# Altium schematic sheet ADC.SchDoc: Data acquisition
size A4; DrawnBy: Daniel Berard; Engineer: Daniel Berard; DocumentNumber: 1; Revision: 1; SheetNumber: 1; SheetTotal: 4; ProjectName: STM
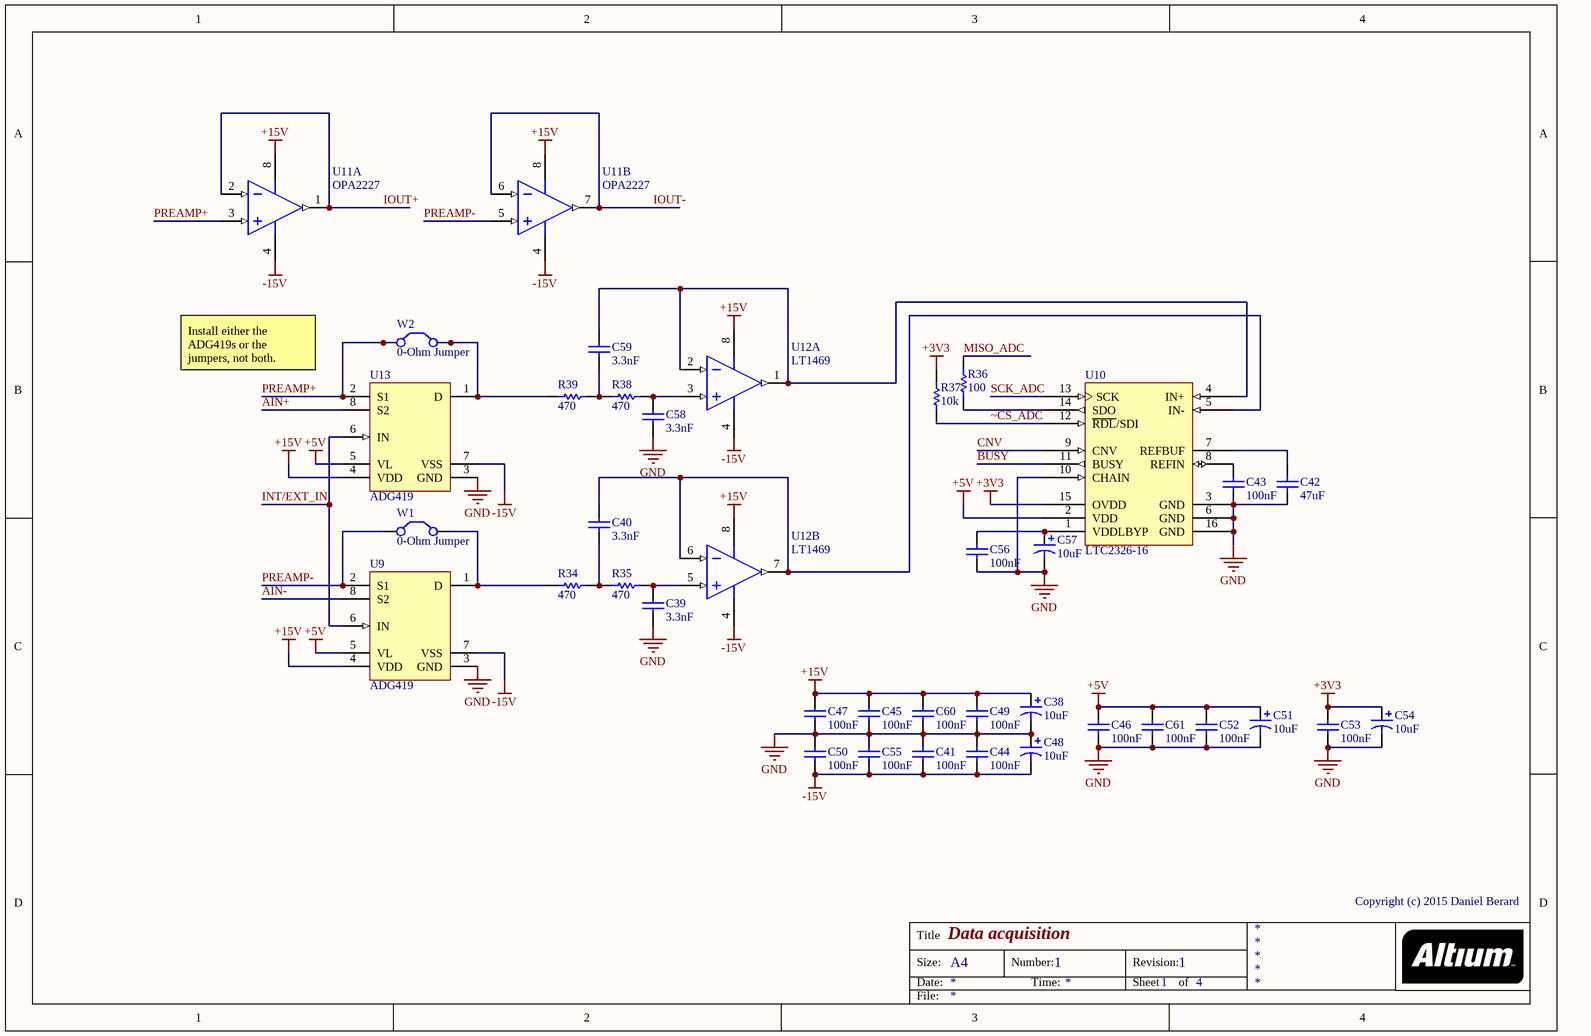
[diagram p0: ADC.SchDoc]

## Parts
C38  10uF  [3528]
C39  3.3nF  [6-0805_N]
C40  3.3nF  [6-0805_N]
C41  100nF  [6-0805_N]
C42  47uF  [C1210]
C43  100nF  [6-0805_N]
C44  100nF  [6-0805_N]
C45  100nF  [6-0805_N]
C46  100nF  [6-0805_N]
C47  100nF  [6-0805_N]
C48  10uF  [3528]
C49  100nF  [6-0805_N]
C50  100nF  [6-0805_N]
C51  10uF  [6-0805_N]
C52  100nF  [6-0805_N]
C53  100nF  [6-0805_N]
C54  10uF  [6-0805_N]
C55  100nF  [6-0805_N]
C56  100nF  [6-0805_N]
C57  10uF  [6-0805_N]
C58  3.3nF  [6-0805_N]
C59  3.3nF  [6-0805_N]
C60  100nF  [6-0805_N]
C61  100nF  [6-0805_N]
R34  470  [6-0805_N]
R35  470  [6-0805_N]
R36  100  [6-0805_N]
R37  10k  [6-0805_N]
R38  470  [6-0805_N]
R39  470  [6-0805_N]
U9  ADG419  [ADI-RM-8_N]
U10  LTC2326-16  [MSOP-16]
U11  OPA2227  [TI-D8_N]  (parts A,B of 2)
U12  LT1469  [LT-S8-8_N]  (parts A,B of 2)
U13  ADG419  [ADI-RM-8_N]
W1  0-Ohm Jumper  [6-0805_N]
W2  0-Ohm Jumper  [6-0805_N]

## Nets
+3V3: C53.2 C54.1 R37.2 U10.15(OVDD)
+5V: C46.2 C51.1 C52.2 C61.2 U9.5(VL) U10.2(VDD) U13.5(VL)
+15V: C38.1 C45.2 C47.2 C49.2 C60.2 U9.4(VDD) U11.8(V+) U12.8(V+) U13.4(VDD)
-15V: C41.1 C44.1 C48.2 C50.1 C55.1 U9.7(VSS) U11.4(V-) U12.4(V-) U13.7(VSS)
GND: C38.2 C39.2 C41.2 C42.1 C43.1 C44.2 C45.1 C46.1 C47.1 C48.1 C49.1 C50.2 C51.2 C52.1 C53.1 C54.2 C55.2 C56.1 C57.2 C58.2 C60.1 C61.1 U9.3(GND) U10.3(GND) U10.6(GND) U10.10(CHAIN) U10.16(GND) U13.3(GND)
AIN+: U13.8(S2)
AIN-: U9.8(S2)
BUSY: U10.11(BUSY)
CNV: U10.9(CNV)
INT/EXT_IN: U9.6(IN) U13.6(IN)
IOUT+: U11.1(OUT_A) U11.2(IN_A-)
IOUT-: U11.6(IN_B-) U11.7(OUT_B)
MISO_ADC: R36.1
PREAMP+: U11.3(IN_A+) U13.2(S1) W2.1(C1)
PREAMP-: U9.2(S1) U11.5(IN_B+) W1.1(C1)
SCK_ADC: U10.13(SCK)
~CS_ADC: R37.1 U10.12(~{RDL}/SDI)
NetC39_1: C39.1 R35.2 U12.5(+IN_B)
NetC40_1: C40.1 U10.5(IN-) U12.6(-IN_B) U12.7(OUT_B)
NetC40_2: C40.2 R34.2 R35.1
NetC42_2: C42.2 U10.7(REFBUF)
NetC43_2: C43.2 U10.8(REFIN)
NetC56_2: C56.2 C57.1 U10.1(VDDLBYP)
NetC58_1: C58.1 R38.2 U12.3(+IN_A)
NetC59_1: C59.1 U10.4(IN+) U12.1(OUT_A) U12.2(-IN_A)
NetC59_2: C59.2 R38.1 R39.2
NetR34_1: R34.1 U9.1(D) W1.2(C2)
NetR36_2: R36.2 U10.14(SDO)
NetR39_1: R39.1 U13.1(D) W2.2(C2)

## Notes on the sheet
- Install either the ADG419s or the jumpers, not both.
- Copyright (c) 2015 Daniel Berard
- Title
- Size:
- Date:
- A4
- Number:
- Time:
- Revision:
- Sheet
- of
- File:

## Library data of the parts
C38 C48 C51 C54 C57 = Cap Pol1: Polarized Capacitor (Radial); Value: 100pF; Published: 8-Jun-2000; LatestRevisionDate: 17-Jul-2002; LatestRevisionNote: Re-released for DXP Platform.; PackageReference: RB7.6-15; Publisher: Altium Limited; PackageDescription: Polarized Capacitor (Radial); 2 Leads
C39-C47 C49 C50 C52 C53 C55 C56 C58-C61 = Cap: Capacitor; Value: 100pF; Published: 8-Jun-2000; LatestRevisionDate: 17-Jul-2002; LatestRevisionNote: Re-released for DXP Platform.; PackageReference: RAD-0.3; Publisher: Altium Limited; PackageDescription: Radial Cap, Thru-Hole; 2 Leads; 0.3 in Pin Spacing
R34-R39 = Res1: Resistor; Value: 1K; Published: 8-Jun-2000; LatestRevisionDate: 17-Jul-2002; LatestRevisionNote: Re-released for DXP Platform.; PackageReference: AXIAL-0.3; Publisher: Altium Limited; PackageDescription: Axial Device, Thru-Hole; 2 Leads; 0.3 in Pin Spacing
U9 U13 = CMP-0792-00196-1: LC2MOS Precision Mini-DIP Analog Switches, 25 Ohm Ron, 8-pin SOP (RM-8), Tube; Manufacturer: Analog Devices; PartNumber: ADG419BRMZ; Ron (ohms): 25, 40; Configuration: SPDT; Max Pos Supply: +16.5V; # Sw Functions: 1; Max Neg Supply: -16.5V; ComponentLink2Description: Datasheet; DatasheetVersion: Rev. C; Code_JEDEC: MO-187-AA; PackageVersion: Aug-05; ComponentLink1Description: Manufacturer URL; Mounting Technology: Surface Mount; ComponentLink3URL: http://www.analog.com/static/imported-files/packages/PKG_PDF/MSOP%28RM%29/RM_8.pdf; Packing: Tube; ComponentLink1URL: http://www.analog.com/en/index.html; ComponentLink3Description: Package Specification; PackageDescription: 8-Pin Mini Small Outline Package, Body 3 x 3 mm, Pitch 0.65 mm; PackageReference: RM-8; ComponentLink2URL: http://www.analog.com/static/imported-files/data_sheets/ADG419.pdf
U11 = CMP-0272-00267-2: High Precision, Low Noise Operational Amplifier, 5 to 36 V, -40 to 85 degC, 8-pin SOIC (D8), Green (RoHS & no Sb/Br); Manufacturer: Texas Instruments; PartNumber: OPA2227U/2K5; Rating: Catalog; Number of Channels: 2; IIB(Max)(pA): 10000; Packing: LARGE T&R; Total Supply Voltage(Max)(+5V is 5, +/-5V is 10): 36; GBW(Typ)(MHz): 8; CMRR(Min)(dB): 120; Offset Drift(Typ)(uV/C): 0.1; Iq per channel(Max)(mA): 3.8; Slew Rate(Typ)(V/us): 2.3; Total Supply Voltage(Min)(+5V is 5, +/-5V is 10): 5; Vio (25C)(Max)(mV): 0.075; Sub Family: High Supply Voltage Amplifier (>=30V), Low Noise Amp (<=10nV/rtHz), Low Offset Voltage Amplifier (<=500uV), Precision Amplifier; ComponentLink2URL: http://www.ti.com/lit/ds/symlink/opa2227.pdf; ComponentLink3Description: Package Specification; PackageDescription: 8-Pin Plastic Small Outline, Body 4.9 x 3.9 mm, Pitch 1.27 mm; Code_JEDEC: MS-012; PackageReference: D8; PackageVersion: 4040047-3/M, 06/2011; Mounting Technology: Surface Mount; DatasheetVersion: SBOS110A; ComponentLink2Description: Datasheet; ComponentLink3URL: http://www.ti.com/litv/pdf/msoi002j; ComponentLink1URL: http://www.ti.com/; Eco-Plan: Green (RoHS & no Sb/Br); ComponentLink1Description: Manufacturer URL
U12 = CMP-0359-02956-2: Dual Channel, 16-Bit Accurate Operational Amplifier, 200 MHz Typical GBW, 30 V/us Typical SR, 10 to 36 V, 8-Pin SOIC (S8-8), Commercial, Pb-Free; Linear Technology Part Number: LT1469-2; PartNumber: LT1469CS8-2#PBF; Manufacturer: Linear Technology; Vos (mV) Typical: 0.05; GBW (MHz) Typical: 200; Vs Min (V): 10; Channels (#): 2; Is (mA) Typical: 4.1; Vs Max (V): 36; SR (V/us) Typical: 30; ComponentLink1Description: Manufacturer URL; ComponentLink2Description: Datasheet; ComponentLink1URL: http://www.linear.com/; PackageReference: LT-S8-8; RoHS: Pb-Free; Mounting Technology: Surface Mount; Type: VFB; PackageDescription: 8-Pin Plastic Small Outline, Body 4.9 x 3.9 mm, Pitch 1.27 mm; PackageVersion: Rev G; ComponentLink3Description: Package Specification; ComponentLink2URL: http://cds.linear.com/docs/en/datasheet/14692f.pdf; ComponentLink3URL: http://cds.linear.com/docs/en/packaging/05081610_G_SO8.pdf; RevisionNote: URLs updated
W1 W2 = Jumper: Jumper Wire; Published: 24-Mar-1999; LatestRevisionDate: 17-Jul-2002; LatestRevisionNote: Re-released for DXP Platform.; PackageReference: RAD-0.2; Publisher: Altium Limited; PackageDescription: Radial Cap, Thru-Hole; 2 Leads; 0.2 in Pin Spacing